# EAGLE design ComeNCap3 (EAGLE 9.6.2)
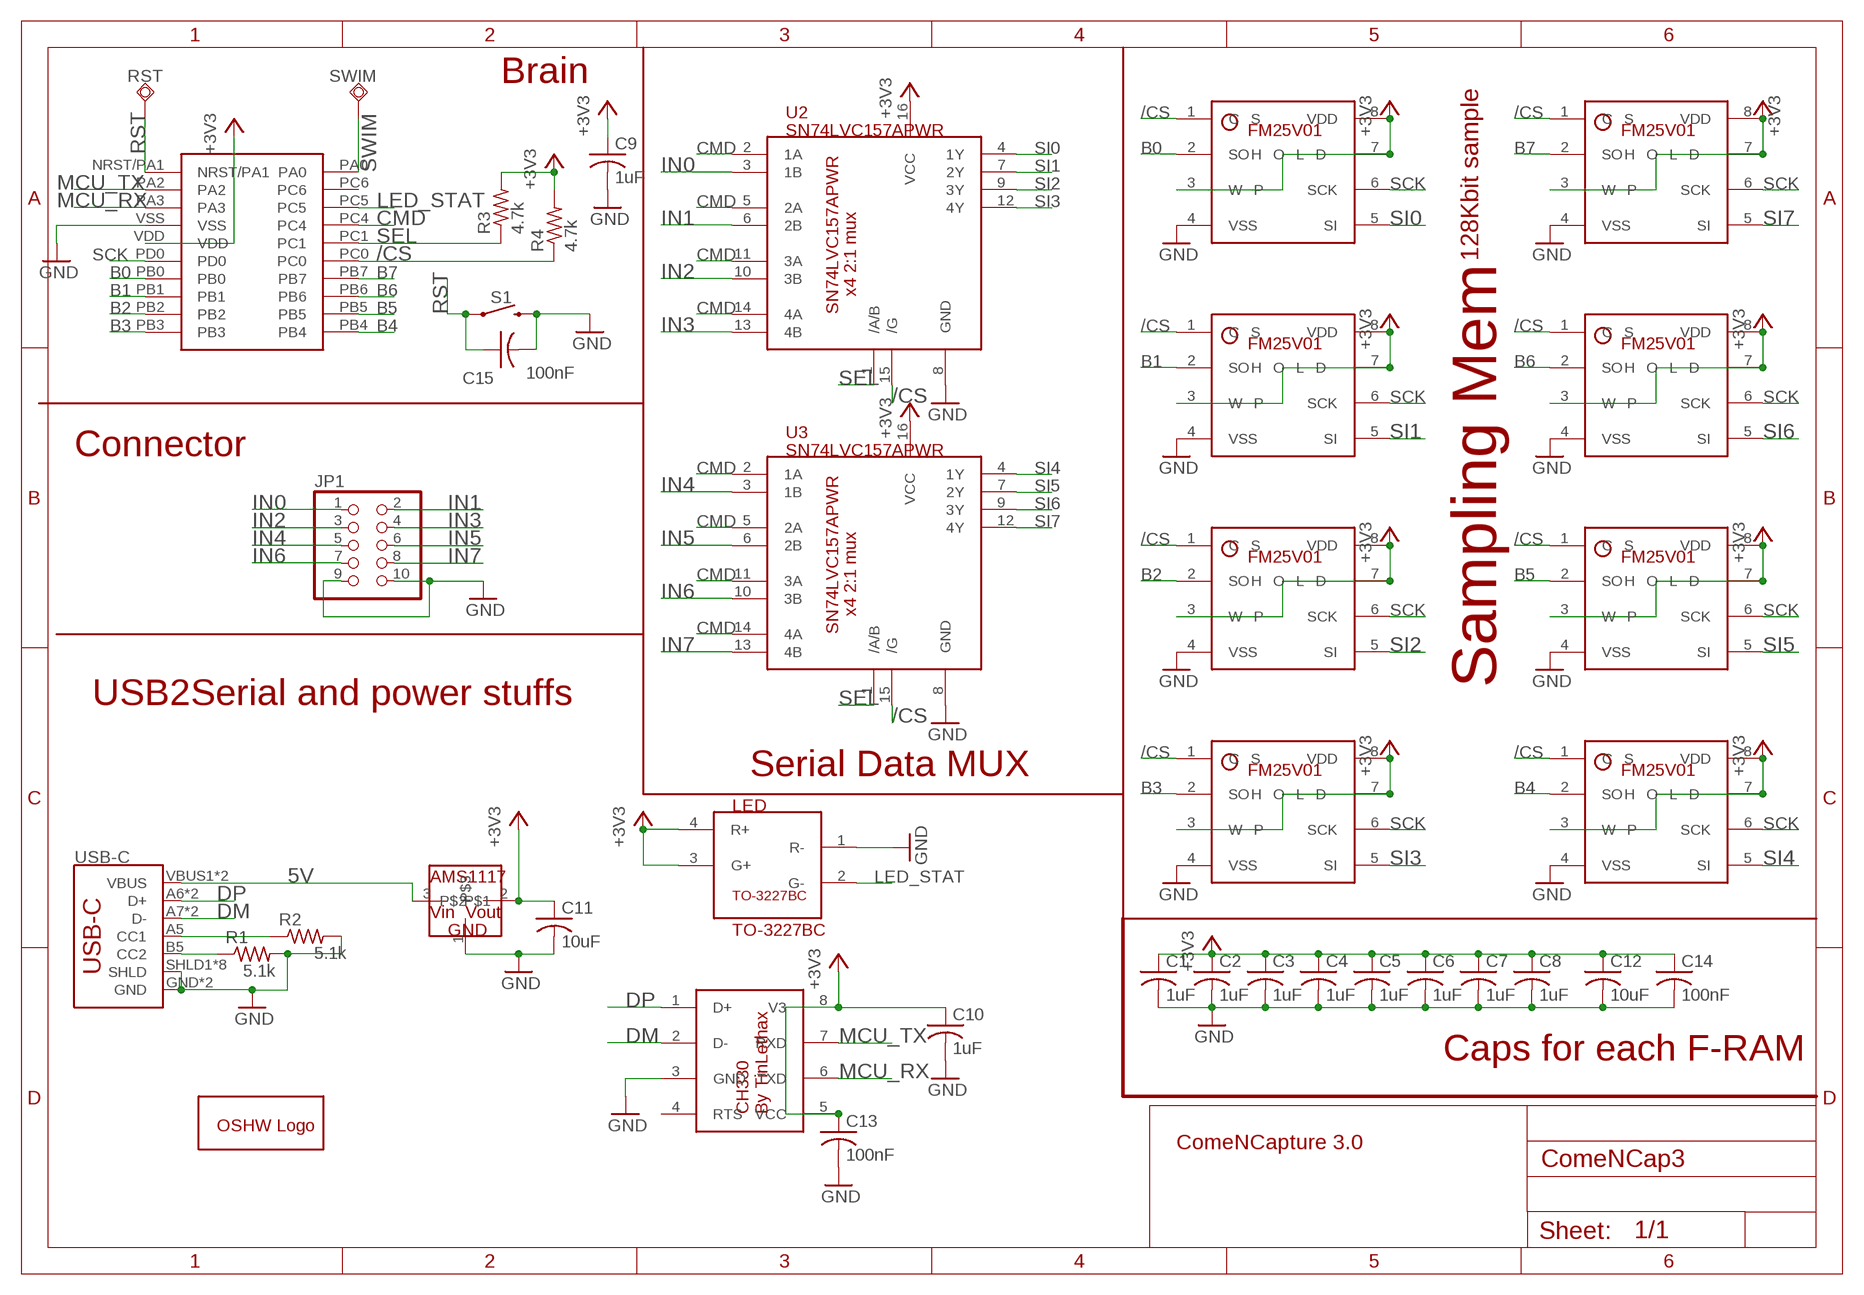
[diagram p0: schematic, sheet 1]

## Parts
C1  1uF  C-USC0603  [C0603]
C2  1uF  C-USC0603  [C0603]
C3  1uF  C-USC0603  [C0603]
C4  1uF  C-USC0603  [C0603]
C5  1uF  C-USC0603  [C0603]
C6  1uF  C-USC0603  [C0603]
C7  1uF  C-USC0603  [C0603]
C8  1uF  C-USC0603  [C0603]
C9  1uF  C-USC0603  [C0603]
C10  1uF  C-USC0603  [C0603]
C11  10uF  C-USC0805  [C0805]
C12  10uF  C-USC0805  [C0805]
C13  100nF  C-USC1206  [C1206]
C14  100nF  C-USC1206  [C1206]
C15  100nF  C-USC1206  [C1206]
GOLD_ORB_SM1  OSHWLOGOLOGO5MM  [OSHW_5MM]
JP1  PINHD-2X5  [2X05]
LED  TO-3227BC  [DIODFN320X270X40-4L]
M0  FM25V01  [SOIC127P601X172-8N]
M1  FM25V01  [SOIC127P601X172-8N]
M2  FM25V01  [SOIC127P601X172-8N]
M3  FM25V01  [SOIC127P601X172-8N]
M4  FM25V01  [SOIC127P601X172-8N]
M5  FM25V01  [SOIC127P601X172-8N]
M6  FM25V01  [SOIC127P601X172-8N]
M7  FM25V01  [SOIC127P601X172-8N]
R1  5.1k  R-US_R0603  [R0603]
R2  5.1k  R-US_R0603  [R0603]
R3  4.7k  R-US_R0603  [R0603]
R4  4.7k  R-US_R0603  [R0603]
RST  TPSQTP20R  [TP20R]
S1  MOMENTARY-SWITCH-SPST-SMD-5.2-REDUNDANT  [TACTILE_SWITCH_SMD_5.2MM]
SWIM  TPSQTP20R  [TP20R]
U1  STM8L151F3  [UFQFPN-20]
U2  SN74LVC157APWR  [SOP65P640X120-16L]
U3  SN74LVC157APWR  [SOP65P640X120-16L]
U4  CH330  [SOIC127P600X150-8N]
U5  AMS1117  [SOT223]
USB-C  USB_C16PIN  [USB-C-16P]

## Nets
5V: U5.3 USB-C.VBUS1(VBUS) USB-C.VBUS2(VBUS)
+3V3: C1.1 C2.1 C3.1 C4.1 C5.1 C6.1 C7.1 C8.1 C9.1 C10.1 C11.1 C12.1 C13.1 C14.1 LED.3(G+) LED.4(R+) M0.3(W̅P̅) M0.7(H̅O̅L̅D̅) M0.8(VDD) M1.3(W̅P̅) M1.7(H̅O̅L̅D̅) M1.8(VDD) M2.3(W̅P̅) M2.7(H̅O̅L̅D̅) M2.8(VDD) M3.3(W̅P̅) M3.7(H̅O̅L̅D̅) M3.8(VDD) M4.3(W̅P̅) M4.7(H̅O̅L̅D̅) M4.8(VDD) M5.3(W̅P̅) M5.7(H̅O̅L̅D̅) M5.8(VDD) M6.3(W̅P̅) M6.7(H̅O̅L̅D̅) M6.8(VDD) M7.3(W̅P̅) M7.7(H̅O̅L̅D̅) M7.8(VDD) R3.2 R4.2 U1.VDD U2.16(VCC) U3.16(VCC) U4.5(VCC) U4.8(V3) U5.2
/CS: M0.1(C̅S̅) M1.1(C̅S̅) M2.1(C̅S̅) M3.1(C̅S̅) M4.1(C̅S̅) M5.1(C̅S̅) M6.1(C̅S̅) M7.1(C̅S̅) R4.1 U1.PC0 U2.15(/G) U3.15(/G)
B0: M0.2(SO) U1.PB0
B1: M1.2(SO) U1.PB1
B2: M2.2(SO) U1.PB2
B3: M3.2(SO) U1.PB3
B4: M4.2(SO) U1.PB4
B5: M5.2(SO) U1.PB5
B6: M6.2(SO) U1.PB6
B7: M7.2(SO) U1.PB7
CMD: U1.PC4 U2.2(1A) U2.5(2A) U2.11(3A) U2.14(4A) U3.2(1A) U3.5(2A) U3.11(3A) U3.14(4A)
DM: U4.2(D-) USB-C.A7(D-) USB-C.B7(D-)
DP: U4.1(D+) USB-C.A6(D+) USB-C.B6(D+)
GND: C1.2 C2.2 C3.2 C4.2 C5.2 C6.2 C7.2 C8.2 C9.2 C10.2 C11.2 C12.2 C13.2 C14.2 C15.2 JP1.9 JP1.10 LED.1(R-) M0.4(VSS) M1.4(VSS) M2.4(VSS) M3.4(VSS) M4.4(VSS) M5.4(VSS) M6.4(VSS) M7.4(VSS) R1.2 R2.2 S1.3 S1.4 U1.VSS U2.8(GND) U3.8(GND) U4.3(GND) U5.1 USB-C.GND USB-C.GND2(GND) USB-C.SHLD1(SHLD) USB-C.SHLD2(SHLD) USB-C.SHLD3(SHLD) USB-C.SHLD4(SHLD) USB-C.SHLD5(SHLD) USB-C.SHLD6(SHLD) USB-C.SHLD7(SHLD) USB-C.SHLD8(SHLD)
IN0: JP1.1 U2.3(1B)
IN1: JP1.2 U2.6(2B)
IN2: JP1.3 U2.10(3B)
IN3: JP1.4 U2.13(4B)
IN4: JP1.5 U3.3(1B)
IN5: JP1.6 U3.6(2B)
IN6: JP1.7 U3.10(3B)
IN7: JP1.8 U3.13(4B)
LED_STAT: LED.2(G-) U1.PC5
MCU_RX: U1.PA3 U4.6(TXD)
MCU_TX: U1.PA2 U4.7(RXD)
N$1: R2.1 USB-C.A5(CC1)
N$2: R1.1 USB-C.B5(CC2)
RST: C15.1 RST.TP S1.1 S1.2 U1.NRST/PA1
SCK: M0.6(SCK) M1.6(SCK) M2.6(SCK) M3.6(SCK) M4.6(SCK) M5.6(SCK) M6.6(SCK) M7.6(SCK) U1.PD0
SEL: R3.1 U1.PC1 U2.1(/A/B) U3.1(/A/B)
SI0: M0.5(SI) U2.4(1Y)
SI1: M1.5(SI) U2.7(2Y)
SI2: M2.5(SI) U2.9(3Y)
SI3: M3.5(SI) U2.12(4Y)
SI4: M4.5(SI) U3.4(1Y)
SI5: M5.5(SI) U3.7(2Y)
SI6: M6.5(SI) U3.9(3Y)
SI7: M7.5(SI) U3.12(4Y)
SWIM: SWIM.TP U1.PA0
Unconnected: U1.PC6 U4.4(RTS)

## Notes on the sheet
- Brain
- 128Kbit sample
- Connector
- Sampling Mem
- USB2Serial and power stuffs
- Serial Data MUX
- Caps for each F-RAM
- ComeNCapture 3.0

## Library data of the parts
C1-C15 = adafruit:C-US: CAPACITOR, American symbol
GOLD_ORB_SM1 = oshw:OSHWLOGO: The OSHW logo for PCB layout
JP1 = pinhead:PINHD-2X5: PIN HEADER
LED = TO-3227BC_LED:TO-3227BC: TO-3227BC-MRMGEE Surface Mount Device LED AlGaInP High Bright Red Water Clear AlGaInP High Bright Green
M0 M1-M7 = FM25V01:FM25V01: The FM25V01A is a 128-Kbit nonvolatile memory employing an advanced ferroelectric process. An F-RAM is nonvolatile and performs reads and writes similar to a RAM. It provides reliable data retention for 151 years while eliminating the complexities, overhead, and system-level reliability problems caused by serial flash, EEPROM, and other nonvolatile memories. Unlike serial flash and EEPROM, the FM25V01A performs write operations at bus speed. No write delays are incurred. Data is written to the memory array immediately after each byte is successfully transferred to the device. The next bus cycle can commence without the need for data polling. In addition, the product offers substantial write endurance compared with other nonvolatile memories. The FM25V01A is capable of supporting 1014 read/write cycles, or 100 million times more write cycles than EEPROM.; PARTNO: FM52V01
R1-R4 = adafruit:R-US_: RESISTOR, American symbol
RST SWIM = testpad:TPSQ: Test pad
S1 = SparkFun-Switches:MOMENTARY-SWITCH-SPST: Momentary Switch (Pushbutton) - SPST Normally-open (NO) SPST momentary switches (buttons, pushbuttons). Variants PTH-12MM - 12mm square, through-hole Momentary Pushbutton Switch - 12mm Square <https://www.sparkfun.com/products/9190> (COM-09190) PTH-6.0MM, PTH-6.0MM-KIT - 6.0mm square, through-hole Mini Pushbutton Switch <https://www.sparkfun.com/products/97> (COM-00097) KIT package intended for soldering kit's - only one side of pads' copper is exposed. PTH-RIGHT-ANGLE-KIT - Right-angle, through-hole Right Angle Tactile Button <https://www.sparkfun.com/products/10791> - Used on SparkFun BigTime Watch Kit <https://www.sparkfun.com/products/11734> SMD-12MM - 12mm square, surface-mount Tactile Button - SMD (12mm) <https://www.sparkfun.com/products/12993> (COM-12993) Used on SparkFun PicoBoard <https://www.sparkfun.com/products/11888> SMD-4.5MM - 4.5mm Square Trackball Switch Used on SparkFun Blackberry Trackballer Breakout <https://www.sparkfun.com/products/13169> SMD-4.6MMX2.8MM - 4.60mm x 2.80mm, surface mount Used on SparkFun SAMD21 Mini Breakout <https://www.sparkfun.com/products/13664> SMD-5.2MM, SMD-5.2-REDUNDANT - 5.2mm square, surface-mount Mini Pushbutton Switch - SMD <https://www.sparkfun.com/products/8720> (COM-08720) Used on Arduino Pro Mini <https://www.sparkfun.com/products/11114> REDUNDANT package connects both switch circuits together SMD-6.0X3.5MM - 6.0 x 3.5mm, surface mount Momentary Reset Switch SMD <https://www.sparkfun.com/products/8229> (COM-08229) SMD-6.2MM-TALL - 6.2mm square, surface mount Tactile Button - SMD (6mm) <https://www.sparkfun.com/products/12992> Used on SparkFun Digital Sandbox <https://www.sparkfun.com/products/12651> SMD-RIGHT-ANGLE - Right-angle, surface mount Used on SparkFun Block for Intel® Edison - Arduino <https://www.sparkfun.com/products/13036>; PROD_ID: SWCH-08247; SF_SKU: COM-08720
U1 = STM8L151F3:STM8L151F3: STM8L151F3 8bit mcuwith the 3x3 mm size !
U2 U3 = SN74LVC157APWR:SN74LVC157APWR: These quadruple 2-line to 1-line data selectors/multiplexers are designed for 1.65-V to 3.6-V VCC operation. The 'LVC157A devices feature a common strobe (G) input. When G is high, all outputs are low. When G is low, a 4-bit word is selected from one of two sources and is routed to the four outputs. The devices provide true data.
U4 = CH330:CH330: CH330 Super small Serial to USB chip; DESCRIPTION: CH330 Super small Serial to USB chip; PACKAGE: SOP8; PARTNO: CH330
U5 = AMS1117:AMS1117: The The AMS1117 series of adjustable and fixed voltage regulators are designed to provide up to1A output current and to operate down to 1V input-to-output differential. The dropout voltage of the device is guaranteed maximum 1.3V, decreasing at lower load currents.; PARTNO: AMS1117
USB-C = SparkFun-Connectors:USB_C: USB Type C 16Pin Connector Super Speed pins not available on the 16-pin purely SMD connector so this part is best for USB 2.0 implementations. D1 and D2 are tied together enabling D+/- no matter which way the cable is plugged into the connector. The two channel configuration pins (CC1/2) are exposed. These are normally connected to ground via 5.1k resistors but can be reconfigured for high current/high power applications.; PROD_ID: CONN-14122

## Board
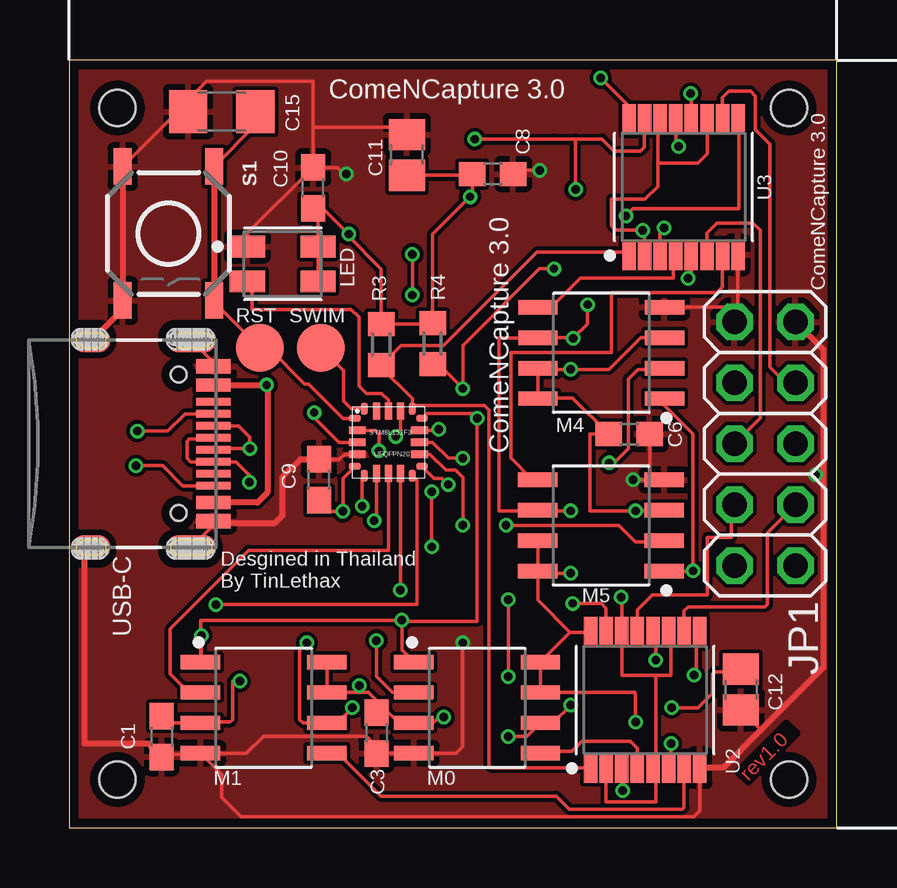
[diagram p1: board, top side]
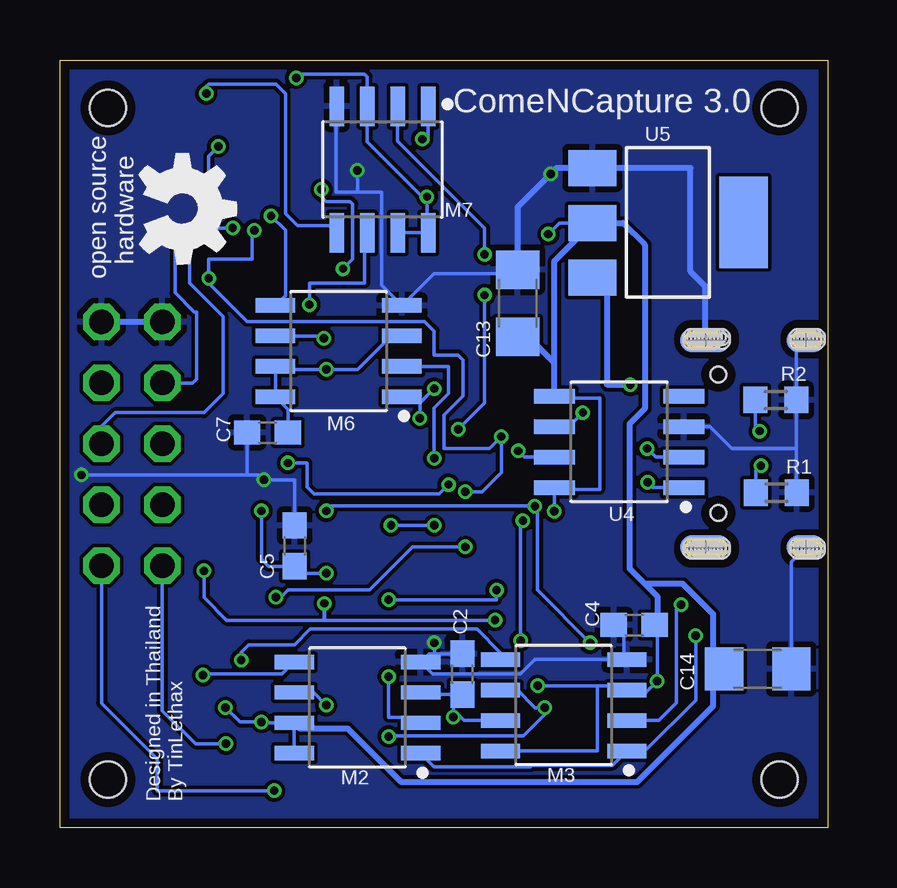
[diagram p2: board, bottom side, seen from below]

Size 32 x 32 mm. Coordinates in mm from the lower left corner, seen from the top.
Outline: 0,0 32,0 32,32 0,32 0,0
Copper layers (1*16): Top 0.035559375mm / dielectric 1.6mm / Bottom 0.035559375mm
Design rules "oshpark-2layer": minimum track width 6mil, minimum drill 10mil, track to track 6mil, track to pad 6mil, pad to pad 6mil, via to via 6mil, smd to smd 6mil, copper to edge 15mil, drill to drill 6mil, minimum pad ring 5mil, minimum via ring 5mil, stop-mask expansion 2.5mil, vias tented up to drill 0mil, thermal gap 10mil
Holes 1.5 mm at 2,2 30,2 2,30 30,30

### Footprints (pad centres in the part's own frame; a part is rotated, then mirrored left to right if it is on the bottom)
C0603 = smd 1.1 x 1: 1 -0.85,0; 2 0.85,0
C0805 = smd 1.3 x 1.5: 1 -0.85,0; 2 0.85,0
C1206 = smd 1.6 x 1.8: 1 -1.4,0; 2 1.4,0
2X05 = drill 1.016 octagon: 1 -5.08,-1.27; 2 -5.08,1.27; 3 -2.54,-1.27; 4 -2.54,1.27; 5 0,-1.27; 6 0,1.27; 7 2.54,-1.27; 8 2.54,1.27; 9 5.08,-1.27; 10 5.08,1.27
DIODFN320X270X40-4L = smd 1.471 x 0.912: 1 -1.475,0.725; 2 -1.475,-0.725; 3 1.475,-0.725; 4 1.475,0.725
SOIC127P601X172-8N = smd 1.641 x 0.602: 1 -2.637,1.905; 2 -2.637,0.635; 3 -2.637,-0.635; 4 -2.637,-1.905; 5 2.637,-1.905; 6 2.637,-0.635; 7 2.637,0.635; 8 2.637,1.905
R0603 = smd 1 x 1.1: 1 -0.85,0; 2 0.85,0
TP20R = smd 2 x 2: TP 0,0
TACTILE_SWITCH_SMD_5.2MM = smd 1.524 x 0.762: 1 -2.794,1.905; 2 2.794,1.905; 3 -2.794,-1.905; 4 2.794,-1.905
UFQFPN-20 = smd 0.5 x 0.3: NRST/PA1 -1.4,1; PB4 1.4,-1; PC0 1.4,1; VDD -1.4,-1 | smd 0.3 x 0.5: PA0 -1,1.4; PB3 1,-1.4; PC1 1,1.4; PD0 -1,-1.4 | smd 0.7 x 0.3: PA2 -1.3,0.5; PA3 -1.3,0; PB5 1.3,-0.5; PB6 1.3,0; PB7 1.3,0.5; VSS -1.3,-0.5 | smd 0.3 x 0.7: PB0 -0.5,-1.3; PB1 0,-1.3; PB2 0.5,-1.3; PC4 0.5,1.3; PC5 0,1.3; PC6 -0.5,1.3
SOP65P640X120-16L = smd 1.272 x 0.564: 1 -2.822,2.275; 2 -2.822,1.625; 3 -2.822,0.975; 4 -2.822,0.325; 5 -2.822,-0.325; 6 -2.822,-0.975; 7 -2.822,-1.625; 8 -2.822,-2.275; 9 2.822,-2.275; 10 2.822,-1.625; 11 2.822,-0.975; 12 2.822,-0.325; 13 2.822,0.325; 14 2.822,0.975; 15 2.822,1.625; 16 2.822,2.275
SOIC127P600X150-8N = smd 1.708 x 0.602: 1 -2.7,1.905; 2 -2.7,0.635; 3 -2.7,-0.635; 4 -2.7,-1.905; 5 2.7,-1.905; 6 2.7,-0.635; 7 2.7,0.635; 8 2.7,1.905
SOT223 = smd 1.499 x 2.007: 1 -2.261,-3.15; 2 0.025,-3.15; 3 2.311,-3.15 | smd 3.81 x 2.007: 4 0,3.15
USB-C-16P = smd 0.3 x 1.45: A5 -1.25,0; A6 -0.25,0; A7 0.25,0; A8 1.25,0; B5 1.75,0; B6 0.75,0; B7 -0.75,0; B8 -1.75,0 | smd 0.6 x 1.45: GND -3.225,0; GND2 3.225,0 | smd 1 x 2.1: SHLD1 -4.32,-0.915; SHLD2 4.32,-0.915 | smd 1 x 2.1 bottom: SHLD3 -4.32,-0.915; SHLD4 4.32,-0.915 | smd 1 x 1.6: SHLD5 -4.32,-5.095; SHLD8 4.32,-5.095 | smd 1 x 1.6 bottom: SHLD6 -4.32,-5.095; SHLD7 4.32,-5.095 | smd 0.55 x 1.45: VBUS1 -2.45,0; VBUS2 2.45,0 | hole 0.65: -2.89,-1.445; 2.89,-1.445; -4.445,-0.318; -4.286,-0.318; -4.445,-0.476; -4.286,-0.476; -4.445,-0.635; -4.286,-0.635; -4.445,-0.794; -4.286,-0.794; -4.445,-0.953; -4.286,-0.953; -4.445,-1.111; -4.286,-1.111; -4.445,-1.27; -4.286,-1.27; -4.445,-1.429; -4.445,-1.587; -4.286,-1.587; 4.445,-0.318; 4.286,-0.318; 4.445,-0.476; 4.286,-0.476; 4.445,-0.635; 4.286,-0.635; 4.445,-0.794; 4.286,-0.794; 4.445,-0.953; 4.286,-0.953; 4.445,-1.111; 4.286,-1.111; 4.445,-1.27; 4.286,-1.27; 4.445,-1.429; 4.286,-1.429; 4.445,-1.587; 4.286,-1.587; 4.445,-4.763; 4.286,-4.763; 4.445,-4.921; 4.286,-4.921; 4.445,-5.08; 4.286,-5.08; 4.445,-5.239; 4.286,-5.239; 4.445,-5.397; 4.286,-5.397; 4.445,-5.556; 4.286,-5.556; -4.445,-4.763; -4.286,-4.763; -4.445,-4.921; -4.286,-4.921; -4.445,-5.08; -4.286,-5.08; -4.445,-5.239; -4.286,-5.239; -4.445,-5.397; -4.286,-5.397; -4.445,-5.556; -4.286,-5.556

### Placement (x,y rotation side)
C1  3.85,3.79 270 top
C2  15.23,6.4 90 bottom
C3  12.8,3.94 270 top
C4  8.06,8.45 180 bottom
C5  22.21,11.74 90 bottom
C6  23.34,16.4 0 top
C7  23.35,16.47 180 bottom
C8  17.65,27.25 0 top
C9  10.4,14.5 90 top
C10  10.16,26.67 90 top
C11  14.07,28.04 90 top
C12  28,5.75 270 top
C13  12.92,21.86 90 bottom
C14  2.91,6.62 0 bottom
C15  6.35,29.84 180 top
GOLD_ORB_SM1  26.9,25.8 270 bottom
JP1  29,16 90 top
LED  8.89,23.5 0 top
M0  17,5 0 top
M1  8.1,5 0 top
M2  19.6,5 180 bottom
M3  11,5.1 180 bottom
M4  22.17,19.79 180 top
M5  22.16,12.59 180 top
M6  20.38,19.86 180 bottom
M7  18.56,27.43 270 bottom
R1  2.14,13.96 0 bottom
R2  2.16,17.83 0 bottom
R3  13,20.14 90 top
R4  15.14,20.17 90 top
RST  7.94,20 0 top
S1  4.13,24.77 270 top
SWIM  10.48,20 0 top
U1  13.3,16.06 0 top
U2  24,5.32 90 top
U3  25.6,26.7 90 top
U4  8.69,16.08 180 bottom
U5  6.65,25.23 270 bottom
USB-C  6,16 270 top

### Tracks (layer width: path | path; a pad name or v marks a point on that pad's centre or on a via)
5V  (via drill 0.35)
  Top 0.254: USB-C.VBUS1 v8.22,18.45 8.26,18.41 8.26,13.97 7.83,13.55 USB-C.VBUS2
  Bottom 0.254: U5.3 9.21,22.33 9.21,18.48 9.17,18.45 v8.22,18.45
+3V3  (via drill 0.35)
  Top 0.152: M1.8 M1.7 12.08,5.63 | 12.08,5.63 12.46,5.63 13.1,5 | 13.1,5 13.73,4.37 M0.3 15.16,4.37 15.4,4.6 v15.6,4.6 | v12.08,5.92 12.08,5.63 | U2.16 20.87,8.14 | 20.87,8.14 M0.8 M0.7 23.57,5.63 23.6,5.6 v23.6,4.4 | C1.1 4.12,4.37 M1.3 5.5,4.4 6.7,4.4 6.8,4.5 6.8,6.1 v7.1,6.1 | C3.1 13.01,5 13.1,5 | U1.VDD 11.4,14.56 v11.4,13.18 10.77,13.18 10.4,13.55 C9.1 | LED.3 LED.4 10.37,25.61 C10.1 10.56,25.82 v11.64,24.74 11.59,24.69 13,23.28 R3.2 15.11,20.98 R4.2 15.14,24.75 v16.7,26.3 16.8,26.4 16.8,27.1 | M5.7 M5.8 | M5.8 19.52,9.49 20.87,8.14 | M4.7 19.53,19.1 | 19.53,19.1 M4.8 19.51,17.91 20.98,17.91 C6.1 21.7,16.4 21.7,13.2 v23.6,13.2 24.77,13.2 M5.3 | M5.8 20.02,10.69 20.1,10.6 v20.9,10.6 | M4.3 23.82,20.43 22.5,19.1 v20.9,19.1 19.53,19.1 | v22.15,31.25 23.32,30.07 U3.16 | C8.1 16.8,27.1 | C11.1 16.71,27.19 16.8,27.1 | C12.1 27.89,6.5 26.9,6.5 26.8,6.4 26.8,5.6 26.2,5 v25.1,5
  Bottom 0.152: v12.08,5.92 9.6,5.92 | 9.6,5.92 8.54,5.92 M3.3 8.48,5.62 7.58,5.62 v7.1,6.1 7.1,8.26 7.1,8.34 C4.1 | M2.8 M2.7 23.57,4.37 v23.6,4.4 24.5,4.4 v25.1,5 | M2.3 16.88,5.55 C2.1 15.6,5.17 15.6,4.9 | 15.6,4.9 v15.6,4.6 | M3.8 9.6,3.2 9.6,5.92 | M3.7 15.16,4.46 15.6,4.9 | v11.4,13.18 11.39,13.19 U4.8 11.31,14.1 9.5,14.1 9.5,17.9 11.3,17.9 U4.5 | U5.2 11.18,25.2 v11.64,24.74 | C14.1 4.75,6.62 4.76,6.6 | v20.9,10.6 21.82,10.6 22.11,10.89 C5.1 23.3,10.89 23.6,11.2 v23.6,13.2 | M7.8 16.7,24.79 | 16.7,24.79 M7.7 | M6.3 18.2,20.5 19.6,19.1 v20.9,19.1 22.89,19.1 M6.7 M6.8 22.5,17.44 C7.1 | v22.15,31.25 22,31.4 19.3,31.4 19.2,31.3 M7.3 19.2,28.59 16.9,26.3 v16.7,26.3 16.7,24.79
  Bottom 0.254: U4.5 11.39,19.37 | 11.39,19.37 11.39,23.61 U5.2 8.53,25.2 7.62,24.3 7.62,17.46 8.26,16.83 8.26,10.79 7.62,10.16 | C13.1 12.48,20.45 11.39,19.37 | 7.1,8.26 7.1,9.64 7.62,10.16 | M2.7 22,4.13 20,4.13 17.78,1.91 7.94,1.91 4.76,5.08 4.76,6.6 4.76,8.89 6.03,10.16 7.62,10.16
/CS  (via drill 0.35)
  Top 0.152: M0.1 13.86,7.41 v13.86,8.64 13.8,8.64 | v20.97,9.34 22.17,9.34 22.38,9.14 U2.15 | v5.5,8 5.5,6.87 M1.1 5.46,8.64 13.8,8.64 | 13.8,8.64 13.84,8.6 17,8.6 v17,17.06 16.8,17.26 14.9,17.26 U1.PC0 | R4.1 15.38,19.32 v16.4,18.3 16.4,20.1 19.6,23.3 v20.2,23.3 | M4.1 24.81,17.59 26,16.4 v26,10.7 25.98,10.69 M5.1 | v16.9,28.7 20.2,28.7 21.1,28.7 | 21.1,28.7 22.2,28.7 22.7,28.2 23.8,28.2 23.98,28.38 U3.15 | v21.1,26.6 21.1,28.7
  Bottom 0.152: M2.1 16.41,2.54 12.38,2.54 12.33,2.6 8.96,2.6 M3.1 7.61,3.19 5.5,5.3 v5.5,8 | v13.86,8.64 21,8.64 21,9.31 v20.97,9.34 20.97,8.64 25.04,8.64 26,9.6 v26,10.7 | v17,17.06 17,17.7 v16.4,18.3 16.95,17.75 17.54,17.75 M6.1 | M7.1 16.66,28.84 16.8,28.7 v16.9,28.7 | v20.2,23.3 19.8,23.7 19.8,26 19.9,26.1 20.9,26.1 21.1,26.3 v21.1,26.6
B0  (via drill 0.35)
  Top 0.152: M0.2 13.46,5.63 12.8,6.3 v12.8,7.8 | U1.PB0 12.8,12.9 v12.7,12.8
  Bottom 0.152: v12.7,12.8 12.8,12.7 v12.8,7.8
B1
  Top 0.152: M1.2 4.96,5.63 4.2,6.4 4.2,8.28 7.47,11.55 13.3,11.55 U1.PB1
B2  (via drill 0.35)
  Top 0.152: U1.PB2 v13.8,9.9 | v18.3,9.5 v18.3,6.3 18.3,6.7
  Bottom 0.152: M2.2 17.2,4.6 18.3,4.6 v18.3,6.3 | v18.3,9.5 13.8,9.5 v13.8,9.9
B3  (via drill 0.35)
  Top 0.152: v6.1,9.3 14.5,9.3 14.5,14.46 U1.PB3
  Bottom 0.152: M3.2 7.04,4.46 6.3,5.2 6.3,9.1 v6.1,9.3
B4  (via drill 0.35)
  Top 0.152: M4.2 24.75,19.1 23.7,19.1 23.3,18.7 23.3,15.8 22.7,15.2 v22.5,15.2 | v15.8,14.3 15.54,14.56 15.2,14.56 U1.PB4
  Bottom 0.152: v15.8,14.3 16.2,13.9 21.4,13.9 21.7,14.2 21.7,15.2 v22.5,15.2
B5  (via drill 0.35)
  Top 0.152: M5.2 24.74,11.9 23.6,11.9 22.9,12.6 v18.2,12.6 | v16.4,12.6 16.4,14.6 16.1,14.9 15.7,14.9 15.04,15.56 U1.PB5
  Bottom 0.152: v18.2,12.6 v16.4,12.6
B6  (via drill 0.35)
  Top 0.152: U1.PB6 15.14,16.06 15.8,15.4 v16.4,15.4
  Bottom 0.152: M6.2 15.8,19.23 15.8,18.1 16.4,17.5 16.4,16.5 16.4,16.4 v16.4,15.4
B7  (via drill 0.35)
  Top 0.152: v14.3,23.9 v14.3,22.2 | v15.4,16.6 15.36,16.56 U1.PB7
  Bottom 0.152: M7.2 17.93,28.62 14.3,25 v14.3,23.9 | v14.3,22.2 14.3,17.7 v15.4,16.6
CMD  (via drill 0.35)
  Top 0.152: 24.4,6.35 23.02,6.35 U2.14 23.02,9.68 23,9.7 v23,9.6 | 24.4,6.35 25.08,6.35 25.08,8.03 U2.11 | U2.2 22.38,1.07 24.45,1.07 24.45,2.37 U2.5 24.45,2.62 24.45,6.3 24.4,6.35 | v15.1,11.7 v15.1,14 | v13.6,16.3 13.6,16.4 13.8,16.6 U1.PC4 | U3.2 23.98,24.82 v23.9,24.9 22.8,24.9 22.6,25.1 22.6,26.2 24,26.2 24.52,26.73 24.52,27.7 | v25.8,22.9 25.93,22.9 U3.5 | U3.11 26.6,29.55 26.6,28.1 26.2,27.7 24.52,27.7 | 24.52,27.7 24.52,29.42 U3.14
  Bottom 0.152: v23,9.6 22.8,9.6 22.5,9.9 19.1,9.9 17.3,11.7 v15.1,11.7 | v15.1,14 14.4,14 13.6,14.8 v13.6,16.3 14.1,15.8 16,15.8 16,17.2 15.2,18 15.2,19.5 15.4,19.7 16.4,19.7 16.4,20.7 16.8,21.1 24.2,21.1 25.8,22.7 v25.8,22.9 25.8,23.7 24,23.7 24,24.8 v23.9,24.9
DM  (via drill 0.35)
  Top 0.152: USB-C.B7 7.05,16.75 7.52,16.28 v7.52,15.8 6.05,15.8 USB-C.A7
  Bottom 0.152: U4.2 7.16,15.45 v7.52,15.8
DP  (via drill 0.35)
  Top 0.152: USB-C.A6 5.95,16.2 5,16.2 4.9,16.1 4.9,15.4 5.05,15.25 USB-C.B6 6.95,15.25 7.5,14.7 v7.5,14.4
  Bottom 0.152: v7.5,14.4 7.28,14.18 U4.1
GND  (via drill 0.35)
  Top 0.152: C1.2 3.94,3.04 5.41,3.04 M1.4 | M0.4 13.1,3.1 12.38,3.81 8.09,3.81 7.37,3.1 M1.4 | M0.4 16.11,3.1 16.39,3.38 v16.39,7.7 | U2.8 26.27,0.7 26.04,0.46 7.16,0.46 6.35,1.27 6.35,2.21 M1.4 | C3.2 M0.4 | C9.2 11.25,15.35 11.46,15.56 U1.VSS | USB-C.SHLD6 0.95,20.32 USB-C.SHLD3 6,19.41 USB-C.GND | USB-C.SHLD7 0.95,11.68 USB-C.SHLD4 6,12.6 USB-C.GND2 | S1.3 4.51,29.84 C15.2 4.95,30.35 5.71,31.11 10.16,31.11 10.16,29.2 | 10.16,29.2 C10.2 | C10.2 11.18,27.52 11.5,27.2 v11.54,27.25 | LED.1 7.42,24.77 C10.2 | M4.4 27.3,21.7 27.73,21.27 27.73,21.2 | 27.73,21.2 JP1.10 | M5.4 24.2,14.49 | 24.2,14.49 v23.5,14.49 v23.5,14.5 | v31.1,14.7 31.43,14.7 | U3.8 27.88,21.34 27.73,21.2 | C6.2 24.2,16.39 24.2,14.49 | C8.2 18.66,27.4 v19.6,27.4 | 10.16,29.2 13.76,29.2 C11.2 | C12.2 28.83,4.07
  Top 0.254: C9.2 9.63,15.35 8.89,14.61 8.89,13.02 8.57,12.7 6.08,12.7 USB-C.GND2 | C1.2 3.29,3.49 0.64,3.49 0.64,11.36 0.95,11.68 | JP1.9 31.43,19.92 31.43,14.7 31.43,6.67 28.83,4.07 27.26,2.5 U2.8 | S1.3 S1.4 2.22,21.59 0.95,20.32
  Bottom 0.152: M2.4 16.39,6.91 v16.39,7.7 | M3.4 8.5,7 | 8.5,7 12.2,7 12.8,6.4 16.46,6.4 M2.4 | C2.2 16.62,7.25 M2.4 | C4.2 8.5,8.04 8.5,7 | 1.31,15.8 R2.2 1.31,19.91 USB-C.SHLD6 | 1.31,15.8 1.31,13.98 R1.2 | USB-C.SHLD7 1.51,11.07 C14.2 | 24.2,14.7 23.7,14.7 v23.5,14.5 22.21,14.5 C5.2 | v31.1,14.7 24.2,14.7 | C7.2 24.2,14.7 | C13.2 13.07,23.1 16.41,23.1 M6.4 18.6,22.62 18.6,26.5 19.6,26.5 | 19.6,26.5 20.5,26.5 20.5,30.03 M7.4 | v19.6,27.4 19.6,26.5 | U4.3 4.92,16.71 4,15.8 1.31,15.8
  Bottom 0.254: C13.2 12.92,25.87 v11.54,27.25 11.3,27.49 U5.1 5.71,27.49 5.71,23.18 5.08,22.55 USB-C.SHLD3 | JP1.10 JP1.9
  pour Top: 0,32 32,32 32,0 0,0
  pour Bottom: 0,32 32,32 32,0 0,0
IN0  (via drill 0.35)
  Top 0.152: v23.07,1.54 23.02,1.54 U2.3
  Bottom 0.152: JP1.1 30.27,5.19 27.94,2.86 27.94,1.54 v23.07,1.54
IN1  (via drill 0.35)
  Top 0.152: v25.08,3.49 25.08,2.6 U2.6
  Bottom 0.152: JP1.2 27.73,4.87 26.35,3.49 v25.08,3.49
IN2
  Top 0.152: JP1.3 29.1,12.29 29.1,9.3 29,9.2 25.8,9.2 25.62,9.03 U2.10
IN3
  Top 0.152: JP1.4 27.6,13.33 27.6,12.1 26.6,12.1 26.6,9.7 24.3,9.7 23.68,9.07 U2.13
IN4  (via drill 0.35)
  Top 0.152: U3.3 24.62,24.82 v24.8,25
  Bottom 0.152: v24.8,25 25.8,25 26.6,24.2 26.6,22.7 25.2,21.3 25.2,18.1 26,17.3 29.7,17.3 30.27,16.73 JP1.5
IN5
  Top 0.152: JP1.6 28.8,17.07 28.8,24.9 28.5,25.2 27,25.2 26.57,24.77 U3.6 26.6,23.85
IN6
  Top 0.152: U3.10 27.23,30.43 27.5,30.7 28.4,30.7 28.6,30.5 28.6,29.1 29.2,28.5 29.2,19.2 29.86,18.54 JP1.7
IN7  (via drill 0.35)
  Top 0.152: U3.13 25.27,28.52 v25.4,28.4
  Bottom 0.152: v25.4,28.4 25.8,28 25.8,25.5 27.2,24.1 27.2,22.3 26.4,21.5 26.3,21.5 26.3,18.7 26.46,18.54 JP1.8
LED_STAT
  Top 0.152: LED.2 7.62,22.57 7.62,21.59 11.75,21.59 12.06,21.27 12.06,18.41 12.38,18.1 13.02,18.1 13.3,17.82 U1.PC5
MCU_RX  (via drill 0.35)
  Top 0.152: U1.PA3 11.24,16.06 10.2,17.1 v10.2,17.3
  Bottom 0.152: v10.2,17.3 10.8,16.7 11.38,16.7 U4.6
MCU_TX  (via drill 0.35)
  Top 0.152: v12.9,15.7 12.9,16.4 12.74,16.56 U1.PA2
  Bottom 0.152: U4.7 12.64,15.45 v12.9,15.7
N$1  (via drill 0.35)
  Top 0.152: USB-C.A5 4.82,17.25 4.1,16.53 v2.83,16.53
  Bottom 0.152: v2.83,16.53 3.01,16.71 R2.1
N$2  (via drill 0.35)
  Top 0.152: USB-C.B5 4.73,14.25 3.9,15.09 v2.78,15.09
  Bottom 0.152: R1.1 2.99,14.88 v2.78,15.09
RST
  Top 0.152: U1.NRST/PA1 11.4,17.06 9.96,18.5 9.81,18.5 8.3,20 RST.TP 6.03,21.91 S1.2 | S1.1 7.75,29.28 C15.1
  Top 0.254: S1.1 S1.2
SCK  (via drill 0.35)
  Top 0.152: v18.3,3.8 19.07,3.8 M0.6 20.16,4.37 v20.9,5.1 | v11.8,5 11.16,4.37 M1.6 9.73,4.37 9.6,4.5 9.6,7.4 v9.9,7.7 | v12.2,13.4 12.2,14.56 U1.PD0 | 19.5,13.2 17.9,13.2 17.9,20.4 19.51,20.4 M4.6 20.98,20.43 v21,20.4 21.6,21 v21.6,21.8 | 19.5,13.2 M5.6 | v20.9,13.2 19.5,13.2
  Bottom 0.152: v20.9,5.1 21.43,5.63 M2.6 | v18.3,3.8 18.27,3.83 12.67,3.83 11.8,4.7 v11.8,5 12.2,5 12.94,5.74 M3.6 | v9.9,7.7 12.1,9.9 12.1,13.1 12.2,13.2 v12.2,13.4 20.9,13.4 v20.9,13.2 | v21,20.4 21.09,20.5 M6.6 | M7.6 19.3,24.69 19.3,22.7 21.6,22.7 v21.6,21.8
SEL
  Top 0.152: U2.1 17.6,2.5 17.5,2.6 17.5,17.4 17.3,17.6 14.44,17.6 U1.PC1 14.3,17.89 13,19.18 R3.1 13.81,20.1 15.6,20.1 19.5,24 23.2,24 U3.1
SI0
  Top 0.152: U2.4 23.68,3.31 23.39,3.59 21.37,3.59 20.95,3.17 19.72,3.17 M0.5
SI1
  Top 0.152: M1.5 11.19,3.1 12.98,1.3 20.3,1.3 20.84,0.76 25.56,0.76 25.62,0.82 U2.7
SI2  (via drill 0.35)
  Top 0.152: v26.04,6.35 26.14,6.45 26.14,8 U2.9
  Bottom 0.152: M2.5 22.74,6.41 25.98,6.41 v26.04,6.35
SI3  (via drill 0.35)
  Top 0.152: v24.45,6.99 24.45,8.02 U2.12
  Bottom 0.152: M3.5 13.64,7.29 14.62,8.27 21.57,8.27 22.23,7.62 24.13,7.62 24.45,7.3 v24.45,6.99
SI4
  Top 0.152: M4.5 20.09,21.7 21.3,22.9 25.18,22.9 25.18,23.78 U3.4
SI5
  Top 0.152: U3.7 27.23,22.52 27,22.3 22.6,22.3 22.6,19.8 18.4,19.8 18.4,15.4 19.3,14.49 M5.5
SI6  (via drill 0.35)
  Top 0.152: v23.2,25.5 23.5,25.8 27.9,25.8 27.9,29.5 U3.9
  Bottom 0.152: M6.5 22.6,22.18 22.6,24.9 v23.2,25.5
SI7  (via drill 0.35)
  Top 0.152: v25.9,30.6 25.93,30.57 U3.12
  Bottom 0.152: M7.5 20.77,25.1 22.1,25.1 22.6,25.6 22.6,30.6 23,31 25.8,31 25.9,30.9 v25.9,30.6
SWIM
  Top 0.152: SWIM.TP 11.43,19.05 11.43,17.78 11.75,17.46 U1.PA0

### Text on the board
Top: rev1.0
tNames: ComeNCapture 3.0 | ComeNCapture 3.0 | ComeNCapture 3.0 | Desgined in Thailand / By TinLethax
bNames: ComeNCapture 3.0 | Designed in Thailand / By TinLethax